# Altium schematic sheet CATS-Vega-Pyro.SchDoc: CATS Vega
size A4; DocumentNumber: Overview; Revision: V1.0; SheetNumber: 10; SheetTotal: 16; Author: Luca Jost; Subtitle: Pyro Channel
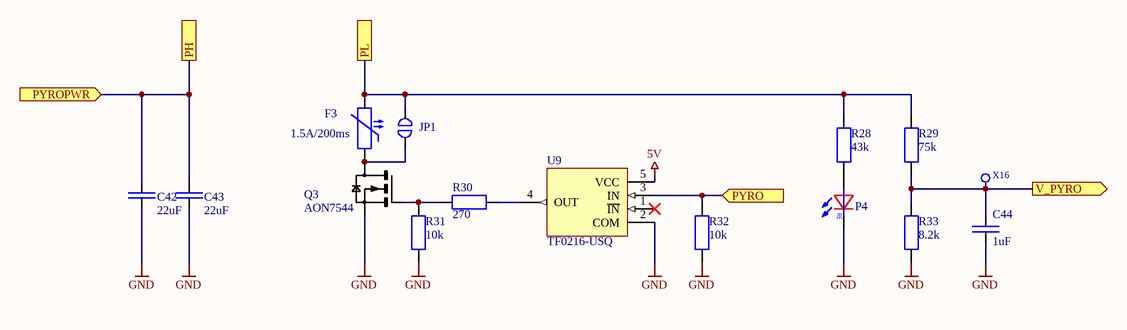
[diagram p0: CATS-Vega-Pyro.SchDoc]

## Parts
C42  22uF  [SMD Keramikkondensator 0805]
C43  22uF  [SMD Keramikkondensator 0805]
C44  1uF  [SMD Keramikkondensator 0603]
F3  1.5A/200ms  [SMD PPTC-Fuse 1206]
JP1  Jumper  [SMD Solder Jumper 1x2mm]  (value not drawn)  (no BOM)
P4  LED  [SMD LED 0603]  (value not drawn)
Q3  AON7544  [SMD MOSFET DFN 3x3 EP]
R28  43k  [SMD Widerstand 0603]
R29  75k  [SMD Widerstand 0603]
R30  270  [SMD Widerstand 0603]
R31  10k  [SMD Widerstand 0603]
R32  10k  [SMD Widerstand 0603]
R33  8.2k  [SMD Widerstand 0603]
U9  TF0216-USQ  [SMD IC SOT-23-5]
X16  -  [SMD Test point 0.8mm]  (value not drawn)  (no BOM)

## Ports
PH, PL, PYRO (in), PYROPWR (in), V_PYRO (out)

## Nets
5V: U9.5(VCC)
GND: C42.1 C43.1 C44.1 P4.K Q3.S R31.1 R32.1 R33.1 U9.2(COM)
PH: C42.2 C43.2 ; port PH, port PYROPWR
PL: F3.1 JP1.1 R28.2 R29.2 ; port PL
PYRO: R32.2 U9.3(IN) ; port PYRO
V_PYRO: C44.2 R29.1 R33.2 X16.1 ; port V_PYRO
NetF3_2: F3.2 JP1.2 Q3.D
NetP4_A: P4.A R28.1
NetQ3_G: Q3.G R30.1 R31.2
NetR30_2: R30.2 U9.4(OUT)

Not connected (* = marked no-connect by the designer): U9 1(~{IN})*

## Notes on the sheet
- Title
- Author:
- Subtitle
- Date:
- Rev:
- File:
- Sheet
- of
- (in symbol LED) RE

## Library data of the parts
C42 C43 = E6 - 22uF: SMD Ceramic Capacitor E6; Unit Price: 0.3453; JLC: C338080
C44 = E6 - 1uF: SMD Ceramic Capacitor E6; Unit Price: 0.0047; JLC: C15849
F3 = ASMD1206-075-30V: Polymeric PTC Resettable Fuse 30V 0.75A Surface Mount 1206; ComponentLink1Description: Datasheet; ComponentLink1URL: https://datasheet.lcsc.com/lcsc/2204011730_Shenzhen-JDT-Fuse-ASMD1206-075-30V_C2982268.pdf; JLC: C2982268; Unit Price: 0.0525
JP1 = Jumper-1: Single Position Jumper
P4 = LED: Color LED; JLC: C84263; Unit Price: 0.01
Q3 = AON7544: N-Channel 30V 30A Surface Mount 8-DFN (3x3); ComponentLink1Description: Datasheet; ComponentLink1URL: https://datasheet.lcsc.com/lcsc/1912111437_Alpha---Omega-Semicon-AON7544_C315567.pdf; JLC: C315567; Digikey: 785-1634-2-ND; Unit Price: 0.1553
R28 = E24 - 43k: SMD Chip Resistor E24; Unit Price: 0.001; JLC: C23172
R29 = E24 - 75k: SMD Chip Resistor E24; Unit Price: 0.001; JLC: C23242
R30 = E24 - 270: SMD Chip Resistor E24; Unit Price: 0.001; JLC: C22966
R31 R32 = E24 - 10k: SMD Chip Resistor E24; Unit Price: 0.001; JLC: C99198
R33 = E24 - 8.2k: SMD Chip Resistor E24; Unit Price: 0.001; JLC: C168409
U9 = TF0216-USQ: SOT-23-5L Gate Drive IC; JLC: C2683769; ComponentLink1Description: Datasheet; ComponentLink1URL: https://datasheet.lcsc.com/lcsc/2106070334_TFSS-TF0216-USQ_C2683769.pdf; Unit Price: 0.3357
X16 = SMD Test point: Test Point SMD